# Altium schematic sheet mcu.SchDoc
size 420 x 297 mm; SheetNumber: 1; SheetTotal: 1; ENG_APP_DATE: --/--/--; DSN_APP_DATE: --/--/--; CHK_APP_DATE: --/--/--
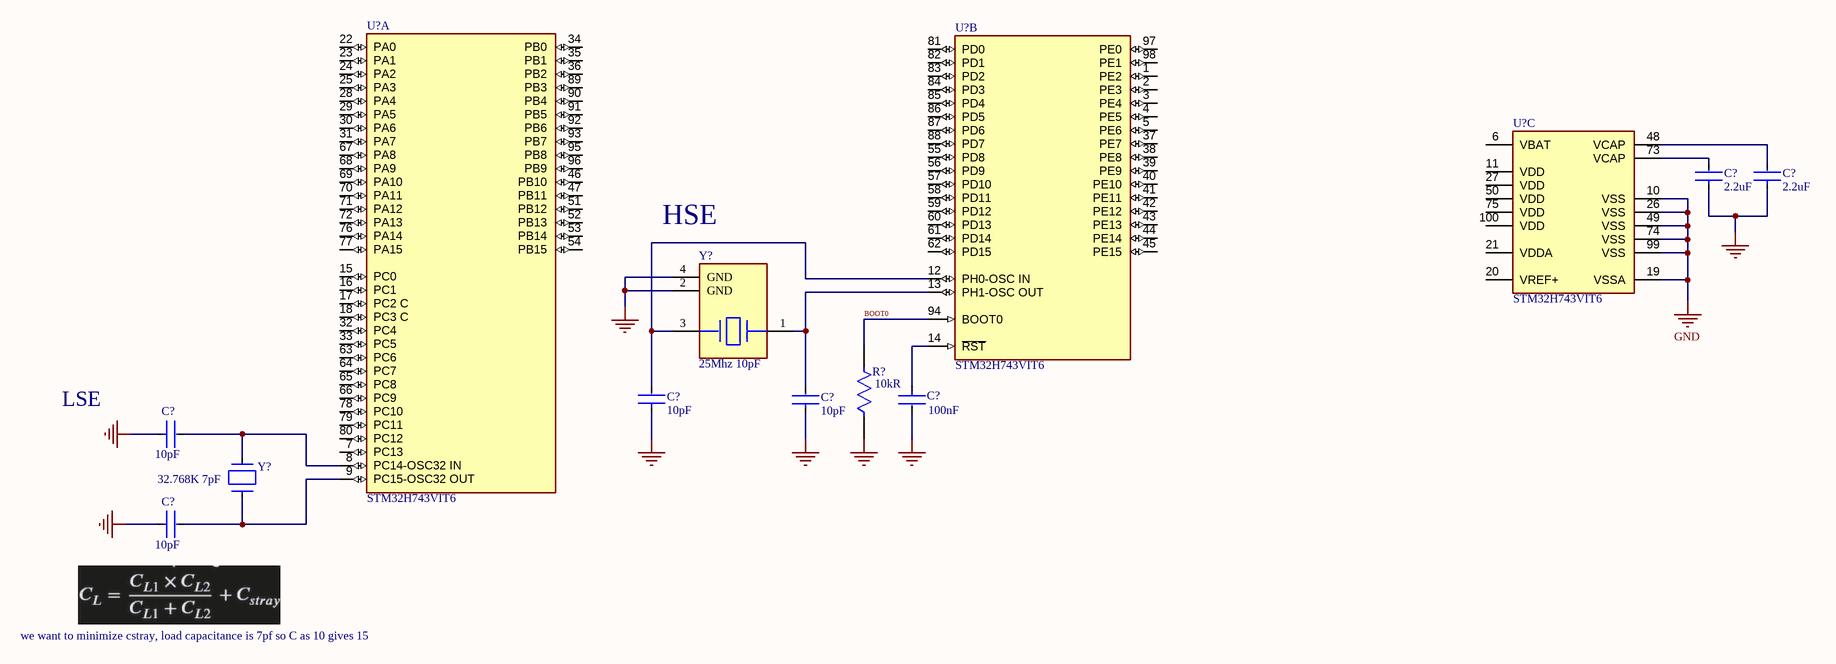
[diagram p0: mcu.SchDoc]

## Parts
(Parts that share a designator on the sheet are numbered #1, #2 ... from top to bottom, then left to right.)
C?#1  Capacitance: 2.2uF  [FP-GCM21B-0_15-IPC_B]  (hidden comment: GCM21BR71A225KA37K)
C?#2  Capacitance: 2.2uF  [FP-GCM21B-0_15-IPC_B]  (hidden comment: GCM21BR71A225KA37K)
C?#3  Capacitance: 100nF  [FP-GCM155-0_05-IPC_A]  (hidden comment: GCM155R71C104KA55J)
C?#4  value 10pF  [FP-GCM188-0_1-IPC_C]  (hidden comment: GCM1885G2A100JA16D)
C?#5  value 10pF  [FP-GCM188-0_1-IPC_C]  (hidden comment: GCM1885G2A100JA16D)
C?#6  value 10pF  [FP-GCM188-0_1-IPC_C]  (hidden comment: GCM1885G2A100JA16D)
C?#7  value 10pF  [FP-GCM188-0_1-IPC_C]  (hidden comment: GCM1885G2A100JA16D)
R?  Resistance: 10kR  [FP-CRCW0603-e3-IPC_A]  (hidden comment: CRCW060310K0FKED)
U?#1  STM32H743VIT6  [FP-LQFP100-1L-MFG]  (part A of 3)
U?#2  STM32H743VIT6  [FP-LQFP100-1L-MFG]  (part B of 3)
U?#3  STM32H743VIT6  [FP-LQFP100-1L-MFG]  (part C of 3)
Y?#1  25Mhz 10pF  [FP-ABM8-MFG]
Y?#2  32.768K 7pF  [FP-ABS09-MFG]

## Nets
GND: C?#1.1 C?#2.1 C?#3.2 C?#4.1 C?#5.1 C?#6.1 C?#7.1 R?.1 U?#3.10(VSS) U?#3.19(VSSA) U?#3.26(VSS) U?#3.49(VSS) U?#3.74(VSS) U?#3.99(VSS) Y?#1.2(GND) Y?#1.4(GND)
BOOT0: R?.2 U?#2.94(BOOT0)
NetC?#1_2: C?#1.2 U?#3.73(VCAP)
NetC?#2_2: C?#2.2 U?#3.48(VCAP)
NetC?#3_1: C?#3.1 U?#2.14(~{RST})
NetC?#4_2: C?#4.2 U?#2.12(PH0-OSC_IN) Y?#1.3
NetC?#5_2: C?#5.2 U?#2.13(PH1-OSC_OUT) Y?#1.1
NetC?#6_2: C?#6.2 U?#1.8(PC14-OSC32_IN) Y?#2.2
NetC?#7_2: C?#7.2 U?#1.9(PC15-OSC32_OUT) Y?#2.1

Not connected (* = marked no-connect by the designer): U?#1 7(PC13) 15(PC0) 16(PC1) 17(PC2_C) 18(PC3_C) 22(PA0) 23(PA1) 24(PA2) 25(PA3) 28(PA4) 29(PA5) 30(PA6) 31(PA7) 32(PC4) 33(PC5) 34(PB0) 35(PB1) 36(PB2) 46(PB10) 47(PB11) 51(PB12) 52(PB13) 53(PB14) 54(PB15) 63(PC6) 64(PC7) 65(PC8) 66(PC9) 67(PA8) 68(PA9) 69(PA10) 70(PA11) 71(PA12) 72(PA13) 76(PA14) 77(PA15) 78(PC10) 79(PC11) 80(PC12) 89(PB3) 90(PB4) 91(PB5) 92(PB6) 93(PB7) 95(PB8) 96(PB9); U?#2 1(PE2) 2(PE3) 3(PE4) 4(PE5) 5(PE6) 37(PE7) 38(PE8) 39(PE9) 40(PE10) 41(PE11) 42(PE12) 43(PE13) 44(PE14) 45(PE15) 55(PD8) 56(PD9) 57(PD10) 58(PD11) 59(PD12) 60(PD13) 61(PD14) 62(PD15) 81(PD0) 82(PD1) 83(PD2) 84(PD3) 85(PD4) 86(PD5) 87(PD6) 88(PD7) 97(PE0) 98(PE1); U?#3 6(VBAT) 11(VDD) 20(VREF+) 21(VDDA) 27(VDD) 50(VDD) 75(VDD) 100(VDD)

## Notes on the sheet
- (near Y?#1) HSE
- LSE
- we want to minimize cstray, load capacitance is 7pf so C as 10 gives 15
- THIS DOCUMENT AND THE DATA DISCLOSED HEREIN OR
- HEREWITH IS THE PROPERTY OF ALTIUM LIMITED AND MAY
- DWG NO:
- REVISION
- REV:
- DESCRIPTION
- DATE
- APPROVED
- BE FREELY DISTRIBUTED IN WHOLE. NO RIGHTS ARE
- RESERVED OR EXPRESS OR IMPLIED WARANTEE GIVEN.
- ENG:
- APPROVALS
- PROJECT
- DSN:
- CHK:
- REFERENCE DOCUMENTS
- PROJECT REVISION:
- TITLE
- DOCUMENT REVISION:
- DESIGN ITEM:
- BOM:
- FAB DWG:
- PCB DWG:
- ASSY DWG:
- SCALE:
- A3
- SIZE
- CAGE CODE
- FILE NAME
- DWG NO.
- SHEET
- OF
- REV

## Library data of the parts
C?#1 C?#2 = CMP-06035-005021-1: Ceramic Capacitor for Automotive 2.2uF ±10% 10VDC X7R 0805 Embossed T/R; Voltage Rating (DC): 10V; Case Code (Metric): 2012; Height: 1.25mm; Mount: Surface Mount; Width: 1.25mm; Package Quantity: 10000; Radiation Hardening: No; Case Code (Imperial): 0805; Min Operating Temperature: -55°C; Depth: 1.25mm; Max Operating Temperature: 125°C; Dielectric: X7R; Length: 2mm; Case/Package: 0805; Packaging: Tape and Reel; Termination: SMD/SMT; Tolerance: 10%
C?#3 = CMP-2008-03712-2: Ceramic Capacitor for Automotive 100nF ±10% 16VDC X7R 0402 Paper T/R; Voltage Rating: 16V; Height: 0.5mm; Width: 0.5mm; Packaging: Tape and Reel; Case Code (Imperial): 0402; Package Quantity: 1; Radiation Hardening: No; Voltage Rating (DC): 16V; Tolerance: 10%; Thickness: 0.022inch; Max Operating Temperature: 125°C; Depth: 0.5mm; Ratings: AEC-Q200; Termination: SMD/SMT; Case Code (Metric): 1005; Min Operating Temperature: -55°C; Dielectric: X7R; Length: 1mm; Case/Package: 0402; Lead Free: Lead Free; Mount: Surface Mount
C?#4-C?#7 = CMP-06035-042496-1: Ceramic Capacitor for Automotive 10pF  ±5% 100VDC X8G 0603 Paper T/R
R? = CMP-02407-003273-1: RES Thick Film, 10kΩ, 1%, 0.1W, 100ppm/°C, 0603; Max Power Dissipation: 100mW; Tolerance: 1%; Packaging: Tape and Reel; Lead Free: Lead Free; Max Operating Temperature: 155°C; Min Operating Temperature: -55°C; Package Quantity: 10000; Length: 0.061inch; Height: 0.02inch; Width: 0.033inch; Composition: Thick Film; Number of Terminations: 2; Case/Package: 0603; Features: Automotive AEC-Q200; Temperature Coefficient: 100ppm/°C
U?#1-U?#3 = CMP-12105-000050-1: IC MCU 32BIT 2MB FLASH 100LQFP; Manufacturer: STMicroelectronics; Number Of Ethernet Channels: 1; Number Of Usb Channels: 2; Number Of A/D Converters: 3; Min Supply Voltage: 1.71V; Ram Size: 1060KBytes; Description: ARM® Cortex®-M7 STM32H7 Microcontroller IC 32-Bit 400MHz 2MB (2M x 8) FLASH 100-LQFP (14x14); Number Of I2C Channels: 4; Frequency: 480MHz; Number Of Adc Channels: 36; Number Of I/Os: 82; Max Supply Voltage: 3.6V; Number Of Spi Channels: 6; Memory Size: 2MBytes; Max Junction Temp: +125°C; Core Architecture: Arm Cortex-M7; Interface: I2C,SPI,UART,USART,USB,LIN,IrDA,Ethernet,I2S,Other; Number Of Timers/Counters: 20; Data Bus Width: 32bits; Number Of Pwm Channels: 42; Number Of Uart Channels: 9; Standoff Height: 0.05mm; Device Class L1: Integrated Circuits (ICs); ComponentLink2URL: https://www.st.com/resource/en/datasheet/stm32h743vi.pdf; Automotive: No; Memory Type: FLASH; Number Of Cores: 1; Temperature Range Low: -40°C; RoHS: TRUE; Ambient Temperature Range Low: -40°C; ComponentLink2Description: Datasheet; Device Class L2: Embedded Processors and Controllers; Device Class L3: Microcontrollers; Digikey Description: IC MCU 32BIT 2MB FLASH 100LQFP; Temperature Range High: +125°C; Ambient Temperature Range High: +85°C; Package: LQFP100-1L; Temperature: -40°C to +125°C; Category: IC; Ipc Land Pattern Name: QFP50P1600X1600X160-100; Height: 1.6mm; Manufacturer Part Number: STM32H743VIT6; Octopart: https://octopart.com/stm32h743vit6-stmicroelectronics-76372527; Lead Free: Yes
Y?#1 = CMP-27762-006353-1: Crystal 25MHz ±10ppm 10pF SMD-4 3.2mm x 2.5mm
Y?#2 = CMP-27762-002676-1: CRYSTAL 32.7680KHZ 7PF SMD; ESR (Equivalent Series Resistance): 70kR; Frequency: 32.768kHz; Frequency Tolerance: 20ppm; Operating Frequency: 32.768 kHz; Series: ABS09; Lead Free: Lead Free; Number of Pins: 2; Length: 0.161inch; RoHS Compliant: Yes; Width: 1.5mm; Mount: Surface Mount; Packaging: Tape and Reel; Case/Package: SMD/SMT; Series Resistance: 70kR; Package Quantity: 3000; Min Operating Temperature: -40°C; Height: 0.035inch; Max Operating Temperature: 85°C; Tolerance: 20ppm; Termination: SMD/SMT; Frequency Stability: 20ppm; Load Capacitance: 7pF